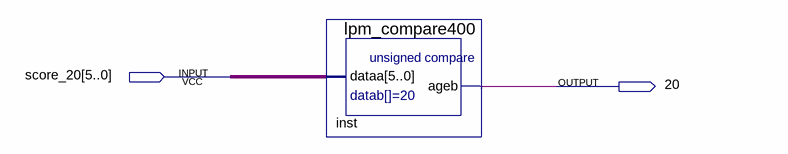
[diagram p0: schematic sheet]
// Quartus schematic 20_compare.bdf as structural Verilog: 1 symbols, 2 pins
module \20_compare  (
  input  [5:0] score_20,
  output \20 
);

  lpm_compare400 inst (.dataa(score_20), .ageb(\20 ));
endmodule
